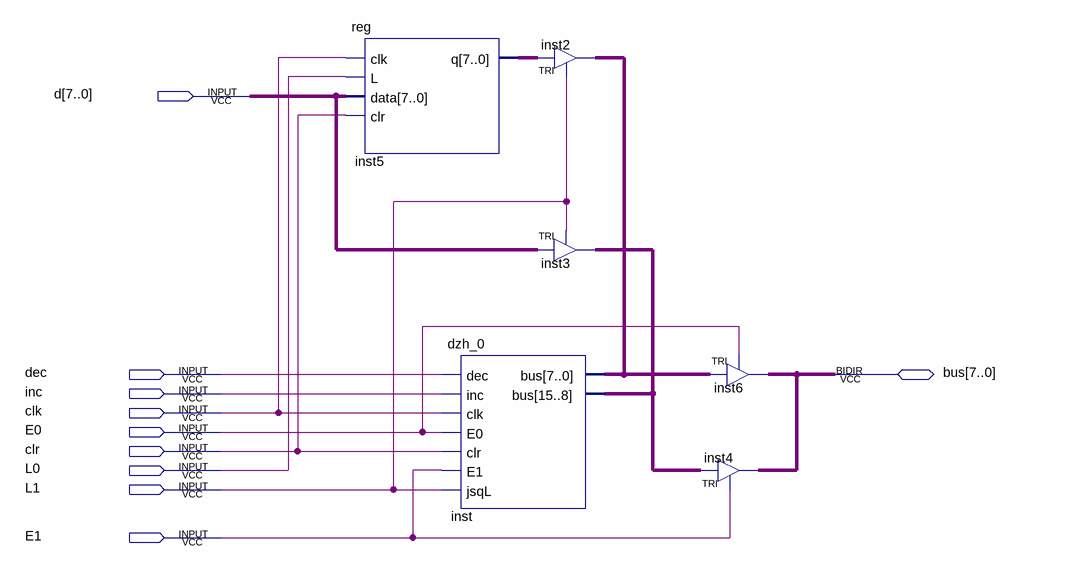
[diagram p0: schematic sheet]
// Quartus schematic dzh.bdf as structural Verilog: 6 symbols, 10 pins
module dzh (
  input  [7:0] d,
  input  dec,
  input  inc,
  input  clk,
  input  E0,
  input  clr,
  input  L0,
  input  L1,
  input  E1,
  inout  [7:0] bus
);

  wire [7:0] inst5_q, inst_bus, inst_bus_2;

  \reg  inst5 (.clk(clk), .L(L0), .data(d), .clr(clr), .q(inst5_q));
  dzh_0 inst (.dec(dec), .inc(inc), .clk(clk), .E0(E0), .clr(clr), .E1(E1), .jsqL(L1), .bus({inst_bus_2, inst_bus}));
  TRI inst2[7:0] (.IN(inst5_q), .OE(L1), .OUT(inst_bus));
  TRI inst3[7:0] (.IN(d), .OE(L1), .OUT(inst_bus_2));
  TRI inst6[7:0] (.IN(inst_bus), .OE(E0), .OUT(bus));
  TRI inst4[7:0] (.IN(inst_bus_2), .OE(E1), .OUT(bus));
endmodule
